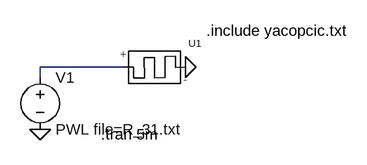
[diagram p0: schematic memristor_resistance_measurement.asc]
memristor_resistance_measurement.asc, the LTspice schematic file:
Version 4
SHEET 1 880 680
WIRE 192 112 64 112
WIRE 64 128 64 112
FLAG 64 208 0
FLAG 288 112 0
SYMBOL memristormodel 272 112 R0
SYMATTR InstName U1
SYMATTR Value MEM_YAKOPCIC
SYMBOL voltage 64 112 R0
WINDOW 123 0 0 Left 2
WINDOW 39 0 0 Left 2
SYMATTR InstName V1
SYMATTR Value PWL file=R_31.txt
TEXT 320 56 Left 2 !.include yacopcic.txt
TEXT 158 216 Left 2 !.tran 5m

The netlist it stands for:
* memristor_resistance_measurement.asc
XU1 N001 0 M MEM_YAKOPCIC  ; pins + -
V1 N001 0 PWL file=R_31.txt
.include yacopcic.txt
.tran 5m
.backanno
.end